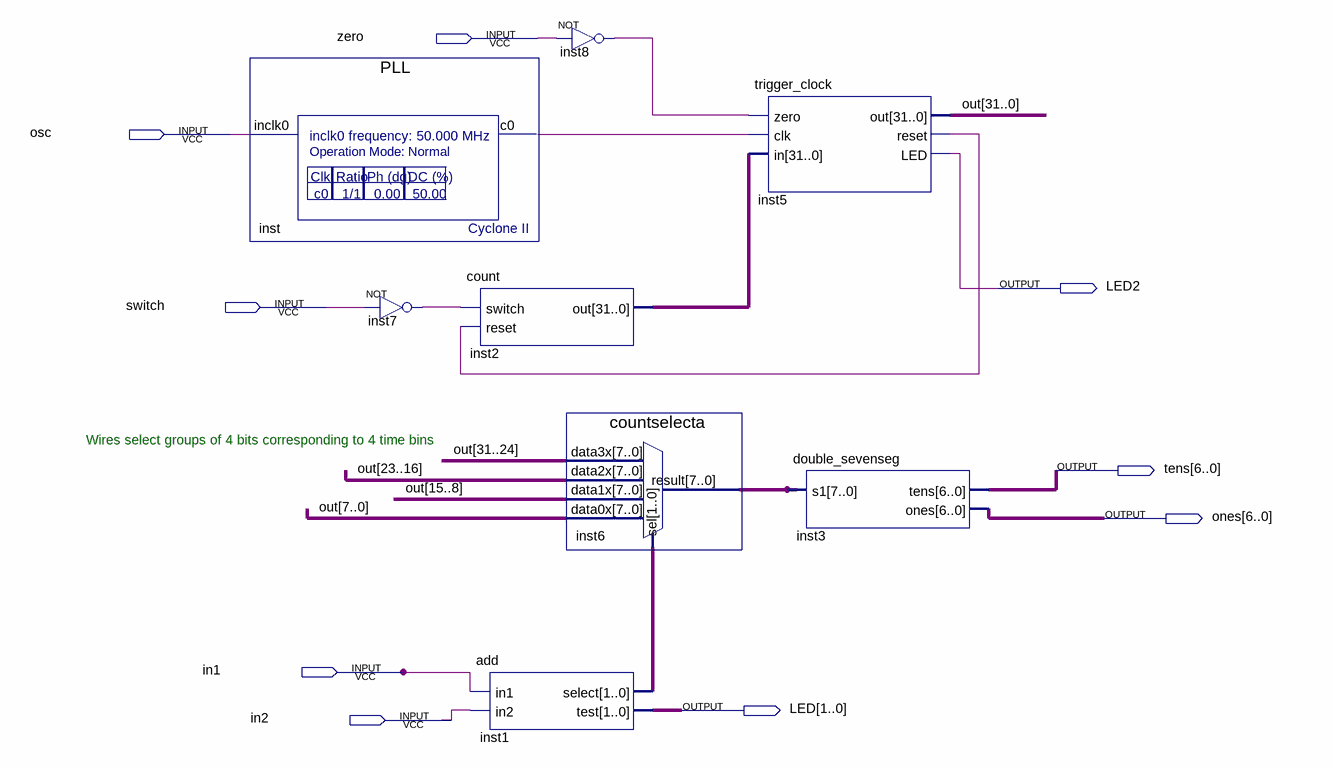
[diagram p0: schematic sheet]
// Quartus schematic TimeBin_SavedCounts.bdf as structural Verilog: 8 symbols, 9 pins
module TimeBin_SavedCounts (
  input  zero,
  input  osc,
  input  switch,
  input  in1,
  input  in2,
  output LED2,
  output [6:0] tens,
  output [6:0] ones,
  output [1:0] LED
);

  wire inst5_reset, inst7_out, inst8_out, inst_c0;
  wire [1:0] inst1_select;
  wire [7:0] inst6_result;
  wire [31:0] inst2_out, out;

  PLL inst (.inclk0(osc), .c0(inst_c0));
  not inst7 (inst7_out, switch);
  count inst2 (.switch(inst7_out), .reset(inst5_reset), .out(inst2_out));
  add inst1 (.in1(in1), .in2(in2), .select(inst1_select), .test(LED));
  not inst8 (inst8_out, zero);
  countselecta inst6 (
    .data3x(out[31:24]), .data2x(out[23:16]), .data1x(out[15:8]), .data0x(out[7:0]), .sel(inst1_select),
    .result(inst6_result));
  trigger_clock inst5 (.zero(inst8_out), .clk(inst_c0), .in(inst2_out), .out(out), .reset(inst5_reset), .LED(LED2));
  double_sevenseg inst3 (.s1(inst6_result), .tens(tens), .ones(ones));

  // Notes on the sheet:
  //   Wires select groups of 4 bits corresponding to 4 time bins
endmodule
